# EAGLE design GSR_REV_1.0 (EAGLE 9.3.0)
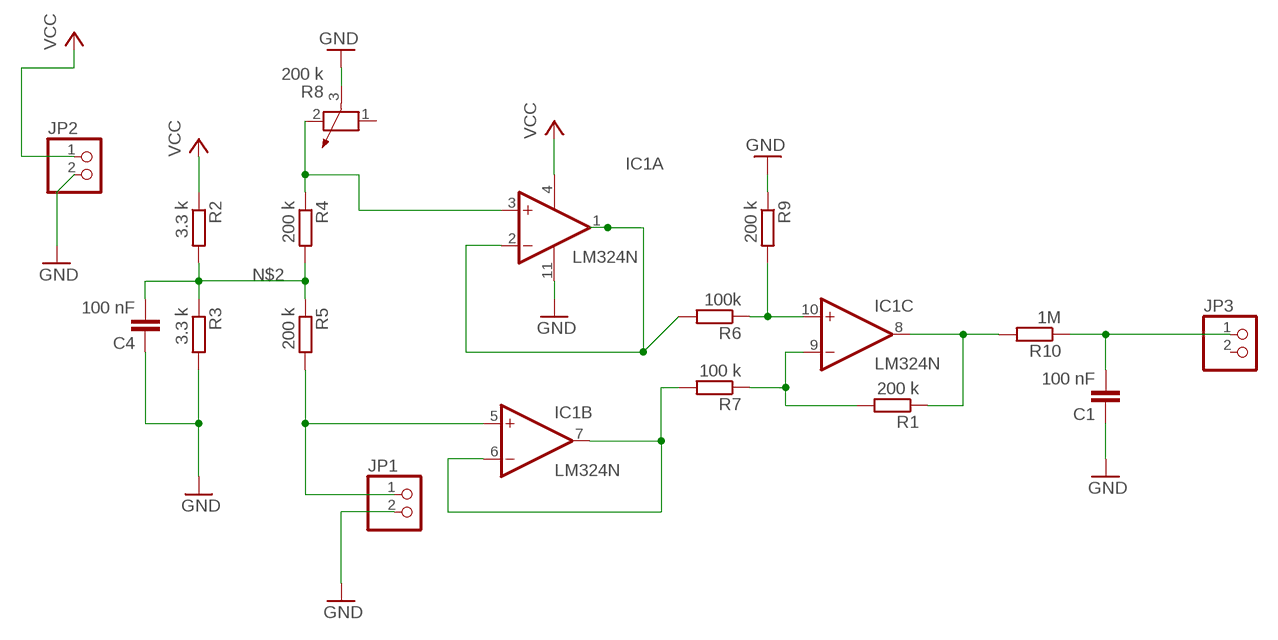
[diagram p0: schematic, sheet 1]

## Parts
C1  100 nF  C-EU025-025X050  [C025-025X050]
C4  100 nF  C-EU025-025X050  [C025-025X050]
IC1  LM324N  [DIL14]
JP1  PINHD-1X2  [1X02]
JP2  PINHD-1X2  [1X02]
JP3  PINHD-1X2  [1X02]
R1  200 k  R-EU_0207/12  [0207/12]
R2  3.3 k  R-EU_0207/12  [0207/12]
R3  3.3 k  R-EU_0207/12  [0207/12]
R4  200 k  R-EU_0207/12  [0207/12]
R5  200 k  R-EU_0207/12  [0207/12]
R6  100k  R-EU_0207/12  [0207/12]
R7  100 k  R-EU_0207/12  [0207/12]
R8  200 k  POTENTIOMETER_PT-10  [PT-10]
R9  200 k  R-EU_0207/12  [0207/12]
R10  1M  R-EU_0207/12  [0207/12]

## Nets
GND: C1.1 C4.1 IC1.11(P:V-) JP1.2 JP2.2 R3.2 R8.3 R9.1
N$2: C4.2 R2.2 R3.1 R4.2 R5.1
N$3: IC1.3(A:+IN) R4.1 R8.2
N$4: IC1.6(B:-IN) IC1.7(B:OUT) R7.2
N$5: IC1.5(B:+IN) JP1.1 R5.2
N$6: C1.2 JP3.1 R10.1
N$7: IC1.10(C:+IN) R6.1 R9.2
N$8: IC1.9(C:-IN) R1.2 R7.1
N$9: IC1.8(C:OUT) R1.1 R10.2
N$10: IC1.1(A:OUT) IC1.2(A:-IN) R6.2
VCC: IC1.4(P:V+) JP2.1 R2.1
Unconnected: IC1.12(D:+IN) IC1.13(D:-IN) IC1.14(D:OUT) JP3.2 R8.1

## Library data of the parts
C1 C4 = rcl:C-EU: CAPACITOR, European symbol; SPICEPREFIX: C
IC1 = linear:LM324: OP AMP
JP1-JP3 = pinhead:PINHD-1X2: PIN HEADER
R1-R7 R9 R10 = rcl:R-EU_: RESISTOR, European symbol; SPICEPREFIX: R
R8 = rcl:POTENTIOMETER_: Potentiometer; SPICEMODEL: POT; SPICEPREFIX: X

## Net classes
0 default: width 0.305 mm, drill 0.508 mm, clearance 0.254 mm

## Board
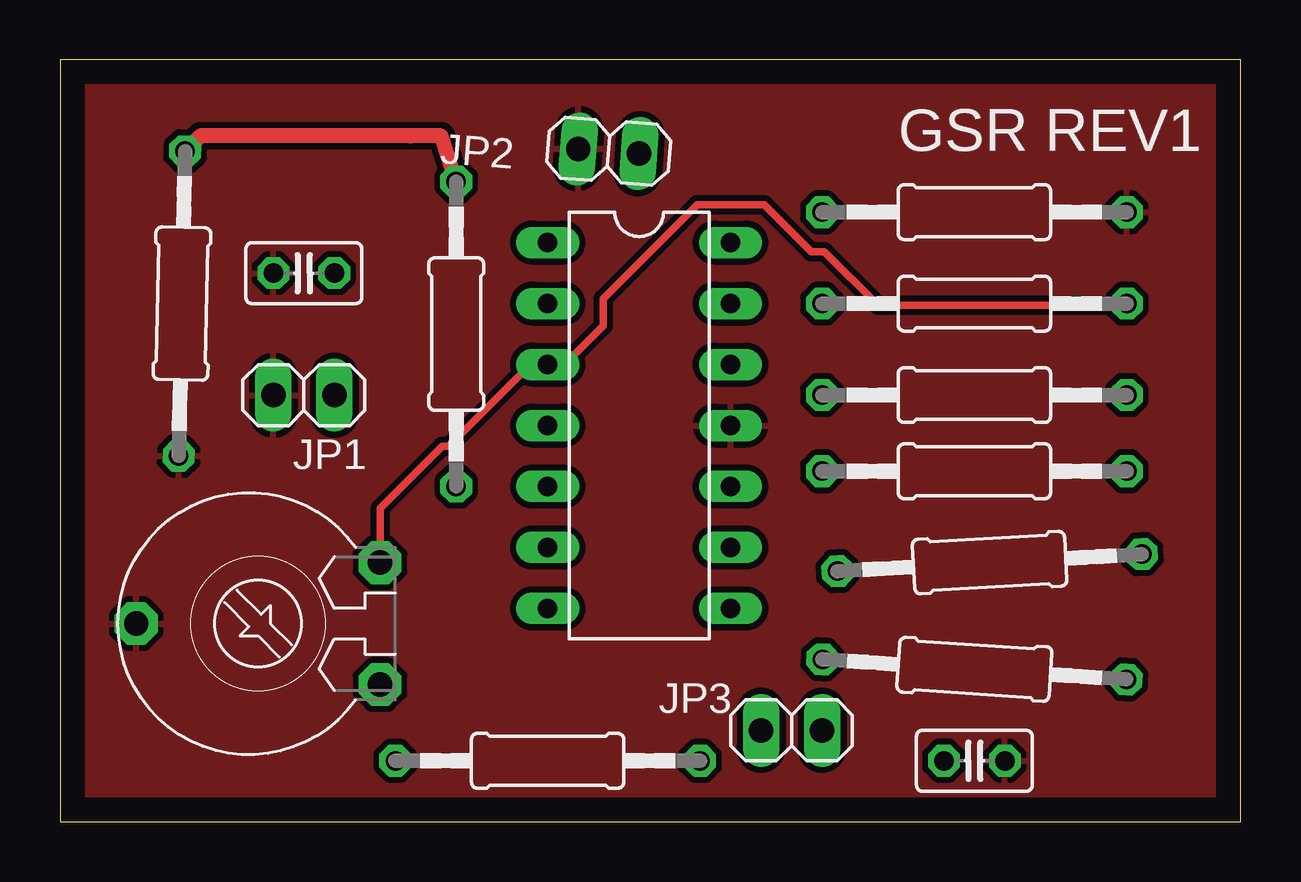
[diagram p1: board, top side]
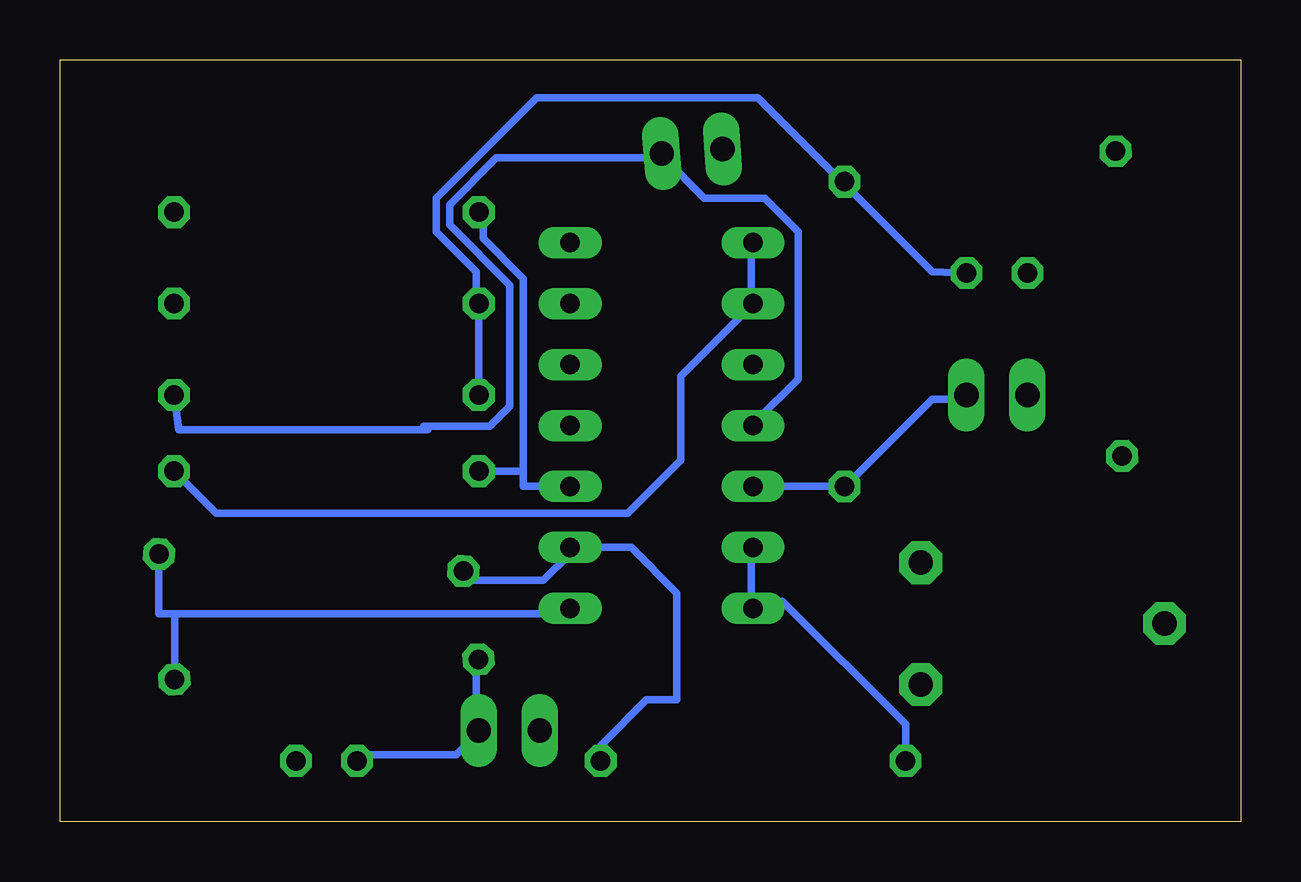
[diagram p2: board, bottom side, seen from below]

Size 49.2 x 31.74 mm. Coordinates in mm from the lower left corner, seen from the top.
Outline: 0,0 49.2,0 49.2,31.74 0,31.74 0,0
Copper layers (1*16): Top 0.035mm / dielectric 1.5mm / Bottom 0.035mm
Design rules "default": minimum track width 6mil, minimum drill 0.35mm, track to track 6mil, track to pad 6mil, pad to pad 6mil, via to via 6mil, smd to smd 6mil, copper to edge 40mil, drill to drill 6mil, minimum pad ring 10mil, minimum via ring 8mil, stop-mask expansion 4mil, vias tented up to drill 0mil, thermal gap 10mil

### Footprints (pad centres in the part's own frame; a part is rotated, then mirrored left to right if it is on the bottom)
C025-025X050 = drill 0.813 octagon: 1 -1.27,0; 2 1.27,0
DIL14 = drill 0.813 long: 1 -7.62,-3.81; 2 -5.08,-3.81; 3 -2.54,-3.81; 4 0,-3.81; 5 2.54,-3.81; 6 5.08,-3.81; 7 7.62,-3.81; 8 7.62,3.81; 9 5.08,3.81; 10 2.54,3.81; 11 0,3.81; 12 -2.54,3.81; 13 -5.08,3.81; 14 -7.62,3.81
1X02 = drill 1.016 long: 1 -1.27,0; 2 1.27,0
0207/12 = drill 0.813 octagon: 1 -6.35,0; 2 6.35,0
PT-10 = drill 1.016 pad 1.778 octagon: 1 -2.54,-5.08; 2 2.54,-5.08; 3 0,5.08

### Placement (x,y rotation side)
C1  38.1,2.54 180 top
C4  10.16,22.86 0 top
IC1  24.13,16.51 270 top
JP1  10.16,17.78 180 top
JP2  22.86,27.94 175.6 top
JP3  30.48,3.81 180 top
R1  38.73,10.79 183.2 top
R2  38.1,17.78 180 top
R3  5.08,21.59 268.8 top
R4  38.1,21.59 180 top
R5  16.51,20.32 270 top
R6  38.1,14.61 0 top
R7  20.32,2.54 180 top
R8  8.26,8.26 90 top
R9  38.1,25.4 180 top
R10  38.1,6.35 356.2 top

### Tracks (layer width: path | path; a pad name or v marks a point on that pad's centre or on a via)
GND
  pour Top: 0,31.75 49.53,31.75 49.53,-1.27 -1.27,-1.27 -1.27,31.75
N$2
  Top 0.635: R5.1 15.88,28.57 14.61,28.57 5.85,28.57 R3.1
  Bottom 0.305: 31.85,17.88 R2.2 R4.2 | 31.85,21.51 R4.2 | 11.46,22.91 C4.2 12.85,22.91 16.48,26.54 R5.1 16.76,26.82 20.12,30.18 29.34,30.18 33.53,25.98 33.53,24.59 31.85,22.91 31.85,21.79 R4.2
N$3
  Top 0.305: R8.2 13.34,13.06 15.93,15.65 16.2,15.65 19.56,19 20.12,19 IC1.3 20.4,19.28 21.23,19.28 22.63,20.68 22.63,21.79 26.54,25.7 29.34,25.7 31.29,23.75 31.85,23.75 34.09,21.51 44.42,21.51 R4.1
N$4
  Bottom 0.305: R7.2 13.97,4.06 19.1,9.2 IC1.7 20.4,8.94 20.4,11.18 IC1.6
N$5
  Bottom 0.305: IC1.5 R5.2 16.48,13.97 12.85,17.6 11.46,17.6 JP1.1
N$6
  Bottom 0.305: R10.1 31.85,6.71 31.85,3.91 JP3.1 31.85,3.63 32.69,2.79 36.6,2.79 C1.2
N$7
  Bottom 0.305: R6.1 29.9,14.61 | IC1.10 29.9,13.97 29.9,14.61 | 29.9,14.61 29.9,22.63 31.57,24.31 31.57,25.15 R9.2
N$8
  Bottom 0.305: R1.2 32.11,10.06 29.06,10.06 27.94,11.18 IC1.9 25.4,11.43 23.5,9.53 23.5,5.08 24.77,5.08 26.67,3.17 R7.1
N$9
  Bottom 0.305: 44.42,8.66 44.42,6.15 R10.2 | 44.42,8.66 27.94,8.66 IC1.8 | R1.1 45.08,8.66 44.42,8.66
N$10
  Bottom 0.305: IC1.1 20.4,24.03 20.4,21.79 IC1.2 23.34,18.57 23.34,15.06 25.55,12.85 42.7,12.85 R6.2
VCC
  Bottom 0.305: IC1.4 20.12,16.76 18.44,18.44 18.44,24.59 19.84,25.98 22.35,25.98 24.03,27.66 JP2.1 24.31,27.66 31.01,27.66 32.97,25.7 32.97,24.87 30.45,22.35 30.45,17.32 31.29,16.48 34.04,16.48 33.88,16.33 44.24,16.33 R2.1

### Text on the board
tPlace: GSR REV1